# EAGLE design Probe (EAGLE 9.6.2)
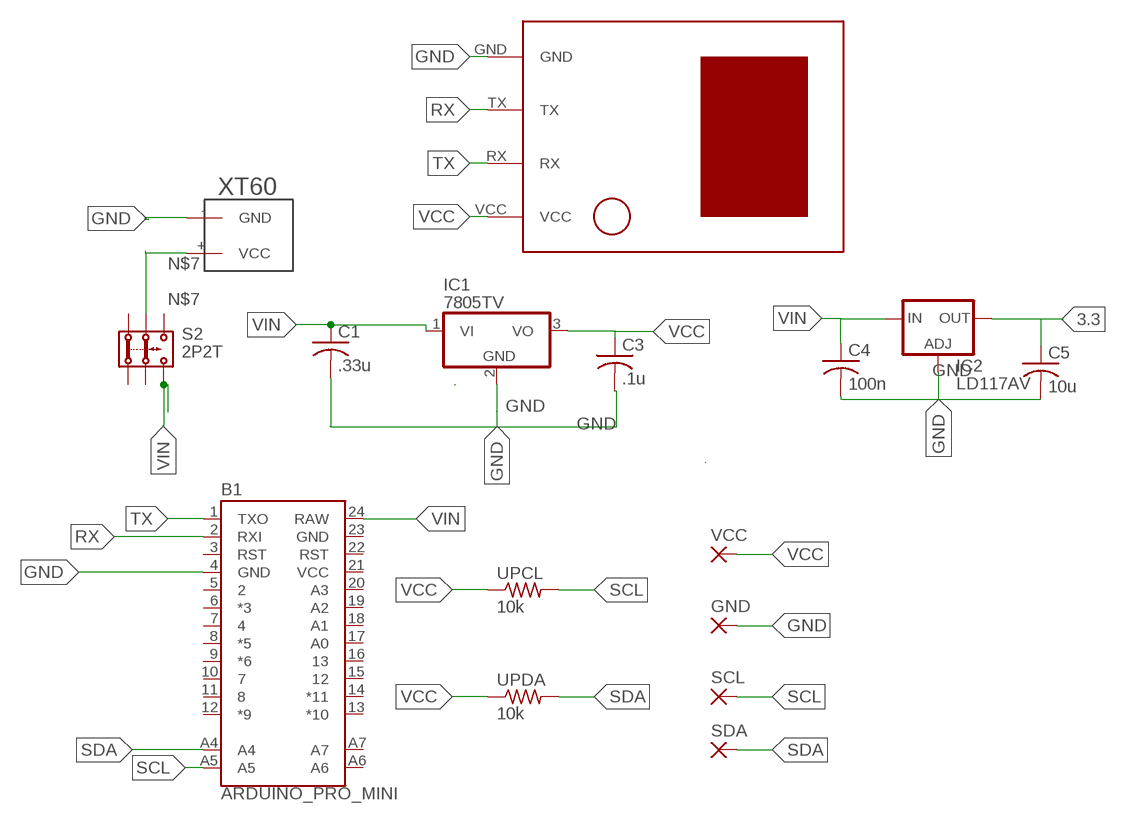
[diagram p0: schematic, sheet 1]

## Parts
B1  ARDUINO_PRO_MINI  [ARDUINO_PRO_MINI]
C1  .33u  C-USC0805  [C0805]
C3  .1u  C-USC0805  [C0805]
C4  100n  C-USC0805  [C0805]
C5  10u  C-USC0805  [C0805]
GND  2,15/1,0  [2,15/1,0]
IC1  7805TV  [TO220V]
IC2  LD117AV  [TO220L1]
S2  2P2T  [2P2T]
SCL  2,15/1,0  [2,15/1,0]
SDA  2,15/1,0  [2,15/1,0]
U$1  U-BLOX-NEO6V2  [U-BLOX-NEO6V2]
U$3  XT60  [XT60]
UPCL  10k  R-US_M0805  [M0805]
UPDA  10k  R-US_M0805  [M0805]
VCC  2,15/1,0  [2,15/1,0]

## Nets
GND: B1.4(GND) C1.2 C3.2 C4.2 C5.2 GND.1(P) IC1.2(GND) IC2.1(ADJ) U$1.GND U$3.-(GND)
N$1: C4.1 IC2.3(IN)
N$3: C3.1 IC1.3(VO)
N$6: C5.1 IC2.2(OUT)
N$7: S2.2.1 U$3.+(VCC)
RX: B1.2(RXI) U$1.TX
SCL: B1.A5 SCL.1(P) UPCL.2
SDA: B1.A4 SDA.1(P) UPDA.2
TX: B1.1(TXO) U$1.RX
VCC: U$1.VCC UPCL.1 UPDA.1 VCC.1(P)
VIN: B1.24(RAW) C1.1 IC1.1(VI) S2.3.2
Unconnected: B1.3(RST) B1.5 B1.6(*3) B1.7 B1.8(*5) B1.9(*6) B1.10 B1.11 B1.12(*9) B1.13(*10) B1.14(*11) B1.15 B1.16 B1.17(A0) B1.18(A1) B1.19(A2) B1.20(A3) B1.22(RST) B1.A6 B1.A7 S2.1.1 S2.1.2 S2.2.2 S2.3.1

## Power pins joined to a net without a drawn wire
GND: B1.23(GND)
VCC: B1.21(VCC)

## Library data of the parts
B1 = SparkFun-Boards:ARDUINO_PRO_MINI: SparkFun Pro Mini Pro Mini compatible footprint. Dimensions: 0.7 x 1.3" PCB Thickness: 0.8mm SparkFun Products: 3.3V/8MHz <https://www.sparkfun.com/products/11114> 5V/16MHz <https://www.sparkfun.com/products/11113>
C1 C3-C5 = adafruit:C-US: CAPACITOR, American symbol
GND SCL SDA VCC = wirepad:2,15/1,0: THROUGH-HOLE PAD
IC1 = linear:78*: Positive VOLTAGE REGULATOR Source: http://cache.national.com/ds/LM/LM78L05.pdf http://www.fairchildsemi.com/ds/LM/LM7805.pdf
IC2 = v-reg:LD117A?*: Low drop fixed and adjustable positive voltage regulators 1 A Source: http://www.st.com/stonline/products/literature/ds/7194/ld1117axx.pdf
S2 = switch:2P2T: SLIDE SWITCH 2P2T Part No. SS-22F05-G(A)4 Source: CANAL ELECTRONIC CO., LTD .. switsch.pdf
U$1 = u-blox neo-6m v2:U-BLOX-NEO6V2
U$3 = XT60:XT60: XT60
UPCL UPDA = adafruit:R-US_: RESISTOR, American symbol

## Board
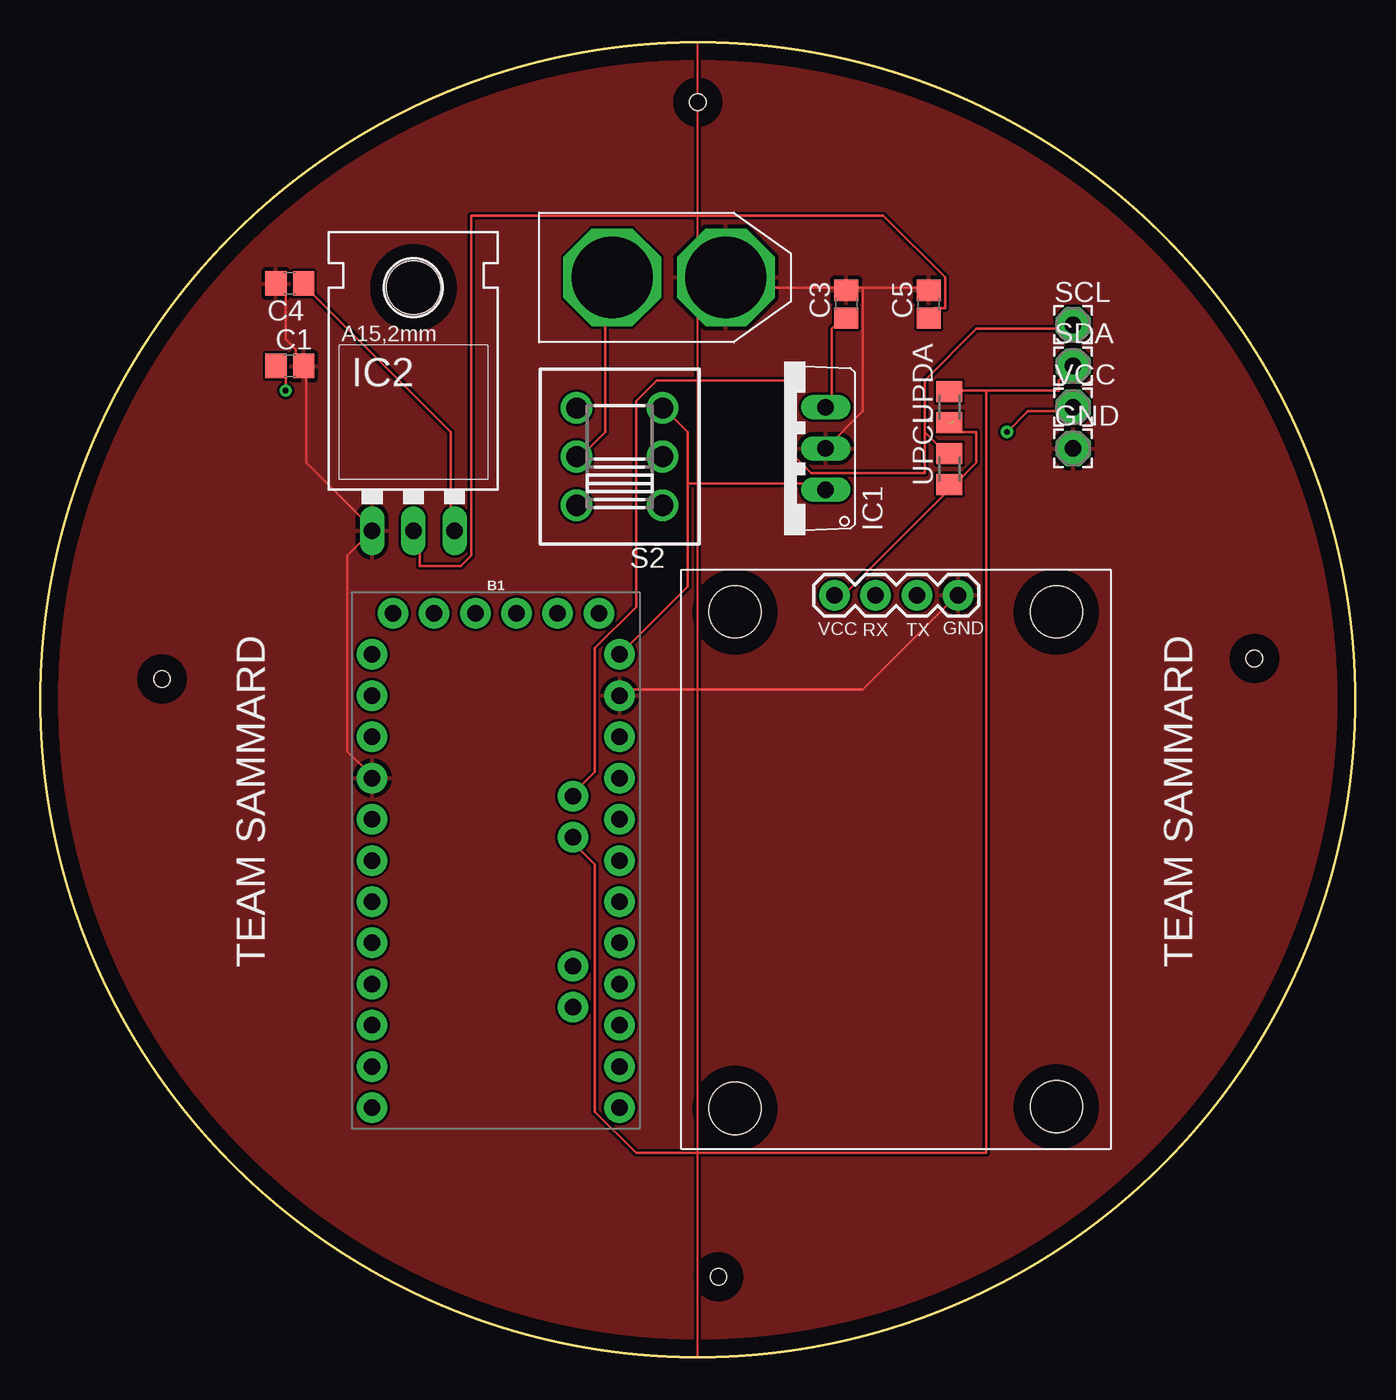
[diagram p1: board, top side]
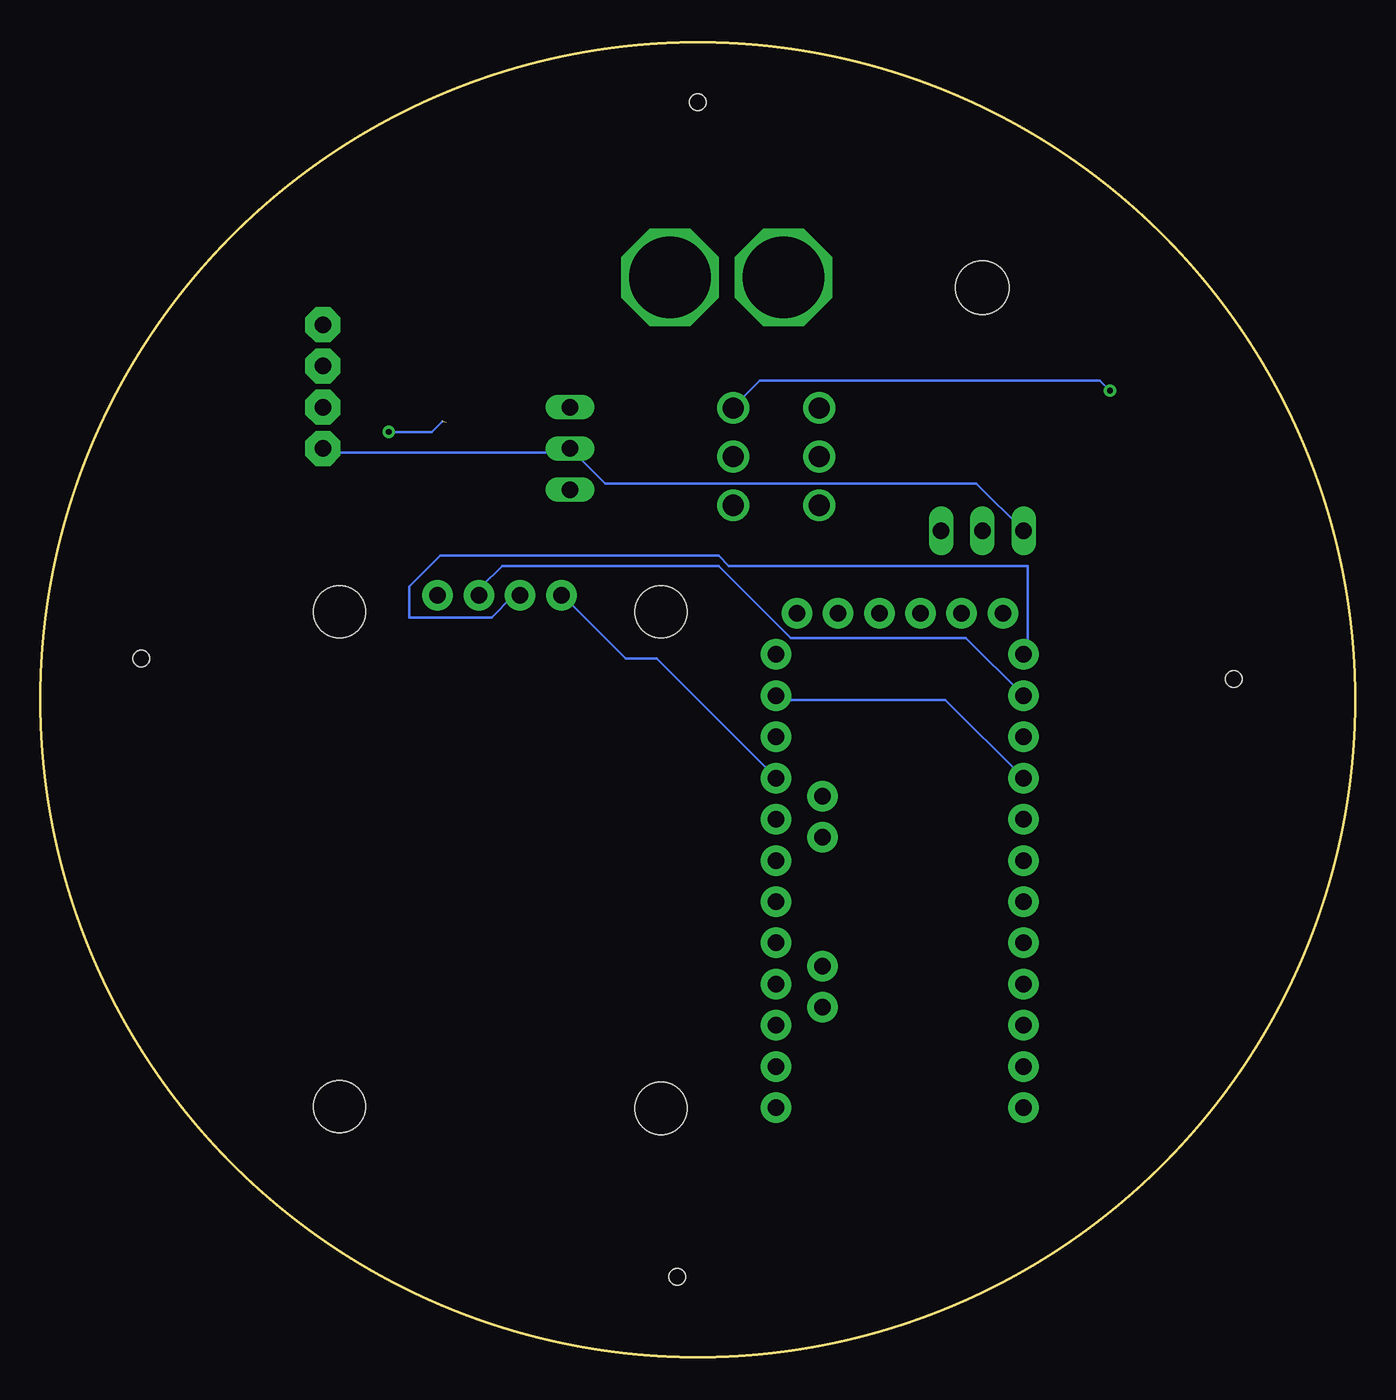
[diagram p2: board, bottom side, seen from below]

Size 81 x 81 mm. Coordinates in mm from the lower left corner, seen from the top.
Outline: circle at 40.5,40.5 radius 40.5
Copper layers (1*16): Top 0.035mm / dielectric 1.5mm / Bottom 0.035mm
Design rules "default": minimum track width 6mil, minimum drill 0.35mm, track to track 6mil, track to pad 6mil, pad to pad 6mil, via to via 6mil, smd to smd 6mil, copper to edge 40mil, drill to drill 6mil, minimum pad ring 10mil, minimum via ring 8mil, stop-mask expansion 4mil, vias tented up to drill 0mil, thermal gap 10mil
Holes 1 mm at 7.48,41.77 74.79,43.04 41.77,4.94 40.5,77.33

### Footprints (pad centres in the part's own frame; a part is rotated, then mirrored left to right if it is on the bottom)
ARDUINO_PRO_MINI = drill 1.016 pad 1.88: 1 -7.62,12.7; 2 -7.62,10.16; 3 -7.62,7.62; 4 -7.62,5.08; 5 -7.62,2.54; 6 -7.62,0; 7 -7.62,-2.54; 8 -7.62,-5.08; 9 -7.62,-7.62; 10 -7.62,-10.16; 11 -7.62,-12.7; 12 -7.62,-15.24; 13 7.62,-15.24; 14 7.62,-12.7; 15 7.62,-10.16; 16 7.62,-7.62; 17 7.62,-5.08; 18 7.62,-2.54; 19 7.62,0; 20 7.62,2.54; 21 7.62,5.08; 22 7.62,7.62; 23 7.62,10.16; 24 7.62,12.7; A4 4.763,1.429; A5 4.763,3.969; A6 4.763,-9.049; A7 4.763,-6.509; BLK -6.35,15.24; GND -3.81,15.24; GRN 6.35,15.24; RXI 1.27,15.24; TXO 3.81,15.24; VCC -1.27,15.24
C0805 = smd 1.3 x 1.5: 1 -0.85,0; 2 0.85,0
2,15/1,0 = drill 1.016 pad 2.159 octagon: 1 0,0
TO220V = drill 1.016 long: 1 -2.54,-2.54; 2 0,-2.54; 3 2.54,-2.54
TO220L1 = drill 1.016 long: 1 -2.54,-3.81; 2 0,-3.81; 3 2.54,-3.81 | hole 3.302: 0,11.176
2P2T = drill 1.3 pad 1.93: 1.1 -3,2.65; 1.2 -3,-2.65; 2.1 0,2.65; 2.2 0,-2.65; 3.1 3,2.65; 3.2 3,-2.65
U-BLOX-NEO6V2 = drill 1.016 pad 1.88: GND 17.05,34.13; RX 11.97,34.13; TX 14.51,34.13; VCC 9.43,34.13 | hole 3.2: 3.3,33.1; 23.1,33.1; 3.3,2.5; 23.1,2.6
XT60 = drill 5 octagon: + 4.5,0; - 11.5,0
M0805 = smd 1.3 x 1.6: 1 -0.95,0; 2 0.95,0

### Placement (x,y rotation side)
B1  28.05,30.59 0 top
C1  15.35,61.07 0 top
C3  49.64,64.88 90 top
C4  15.35,66.15 180 top
C5  54.72,64.88 90 top
GND  63.61,55.99 0 top
IC1  45.83,55.99 90 top
IC2  22.97,54.72 0 top
S2  35.67,55.49 90 top
SCL  63.61,63.61 0 top
SDA  63.61,61.07 0 top
U$1  39.48,12.81 0 top
U$3  30.72,66.54 0 top
UPCL  55.99,54.72 90 top
UPDA  55.99,58.53 90 top
VCC  63.61,58.53 0 top

### Tracks (layer width: path | path; a pad name or v marks a point on that pad's centre or on a via)
GND
  Top 0.152: 50.66,65.9 54.47,65.9 C5.2 | 50.66,65.9 50.03,65.9 C3.2 49.39,65.9 42.41,65.9 42.41,66.54 U$3.- | IC1.2 50.66,58.28 50.66,65.9 | C4.2 15.1,65.9 15.1,62.73 15.74,62.09 15.74,61.46 C1.2 16.37,60.82 16.37,55.11 20.18,51.3 IC2.1 18.91,49.39 18.91,37.33 20.18,36.06 B1.4 | U$1.GND 56.38,46.85 50.66,41.14 36.06,41.14 B1.23
  Bottom 0.152: GND.1 63.36,55.74 48.76,55.74 IC1.2 46.22,53.84 23.36,53.84 IC2.1 | B1.4 25.26,40.5 35.42,40.5 B1.23
  pour Top: 65.9,83.68 67.17,82.41 86.22,63.36 86.22,50.66 86.22,21.45 62.09,-2.68 13.83,-2.68 12.56,-1.41 -1.41,12.56 -1.41,83.68 25.26,83.68 59.55,83.68 64.63,83.68
N$1
  Top 0.152: C4.1 16.37,65.9 25.26,57.01 25.26,51.3 IC2.3
N$3
  Top 0.152: C3.1 49.39,64 48.76,63.36 48.76,58.92 IC1.3
N$6
  Top 0.152: C5.1 55.11,64.63 55.74,64.63 55.74,66.54 51.93,70.35 26.53,70.35 26.53,49.39 25.9,48.76 23.36,48.76 23.36,50.66 IC2.2
N$7
  Top 0.152: S2.2.1 33.52,55.74 34.79,57.01 34.79,66.54 U$3.+
RX
  Bottom 0.152: B1.2 23.99,44.31 34.79,44.31 39.23,48.76 52.57,48.76 53.84,47.49 U$1.TX
SCL
  Top 0.152: 54.47,57.01 55.74,55.74 UPCL.2 | 54.47,57.01 54.47,60.19 57.65,63.36 63.36,63.36 SCL.1 | 54.47,57.01 54.47,54.47 47.49,54.47 46.22,55.74 46.22,60.19 37.96,60.19 36.69,58.92 36.69,46.22 34.15,43.68 34.15,36.06 32.88,34.79 B1.A5
SDA
  Top 0.152: 58.28,59.55 62.73,59.55 62.73,60.19 SDA.1 | 58.28,59.55 56.38,59.55 UPDA.2 | 58.28,59.55 58.28,12.56 36.69,12.56 34.15,15.1 34.15,30.34 32.88,31.61 B1.A4
TX
  Bottom 0.152: B1.1 20.18,43.68 20.18,48.76 38.6,48.76 39.23,49.39 56.38,49.39 58.28,47.49 58.28,45.58 53.2,45.58 51.93,46.85 U$1.RX
VCC  (via drill 0.35)  (1 unrouted)
  Top 0.152: U$1.VCC 49.39,46.85 55.74,53.2 UPCL.1 56.38,53.84 57.65,55.11 57.65,57.01 56.38,57.01 UPDA.1 | VCC.1 63.36,58.28 60.82,58.28 v59.55,57.01
  Bottom 0.152: B1.21 43.04,43.04 44.95,43.04 48.76,46.85 U$1.VCC | 64,58.28 VCC.1 | v59.55,57.01 58.28,57.01 56.88,57.01 56.25,57.65
VIN  (via drill 0.35)
  Top 0.152: v15.1,59.55 15.1,60.82 C1.1 | 39.87,53.84 48.12,53.84 IC1.1 | 39.87,53.84 39.87,57.01 38.6,58.28 S2.3.2 | B1.24 39.87,47.49 39.87,53.84
  Bottom 0.152: v15.1,59.55 15.74,60.19 36.69,60.19 37.96,58.92 S2.3.2
(copper drawn outside any net)
  shapes: Top area x1

### Text on the board
tNames: TEAM SAMMARD | TEAM SAMMARD